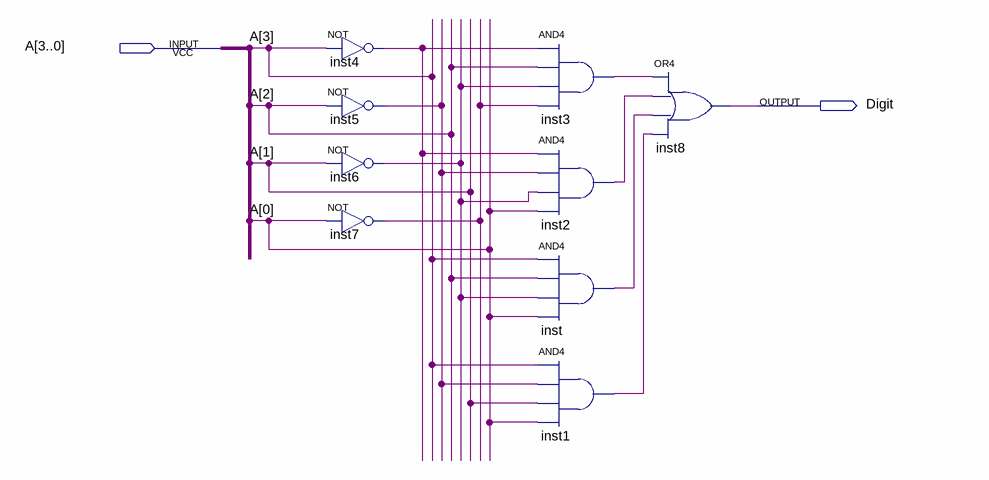
[diagram p0: schematic sheet]
// Quartus schematic sevensegment0.bdf as structural Verilog: 9 symbols, 2 pins
module sevensegment0 (
  input  [3:0] A,
  output Digit
);

  wire inst1_out, inst2_out, inst3_out, inst4_out, inst5_out, inst6_out, inst7_out, inst_out;

  not inst4 (inst4_out, A[3]);
  not inst5 (inst5_out, A[2]);
  not inst6 (inst6_out, A[1]);
  not inst7 (inst7_out, A[0]);
  and inst3 (inst3_out, inst4_out, A[2], inst6_out, inst7_out);
  and inst2 (inst2_out, inst4_out, inst5_out, inst6_out, A[0]);
  and inst (inst_out, A[3], A[2], inst6_out, A[0]);
  and inst1 (inst1_out, A[3], inst5_out, A[1], A[0]);
  or inst8 (Digit, inst3_out, inst2_out, inst_out, inst1_out);
endmodule
